# Altium schematic sheet TL074.SchDoc
size A4; SheetNumber: 2; SheetTotal: 3
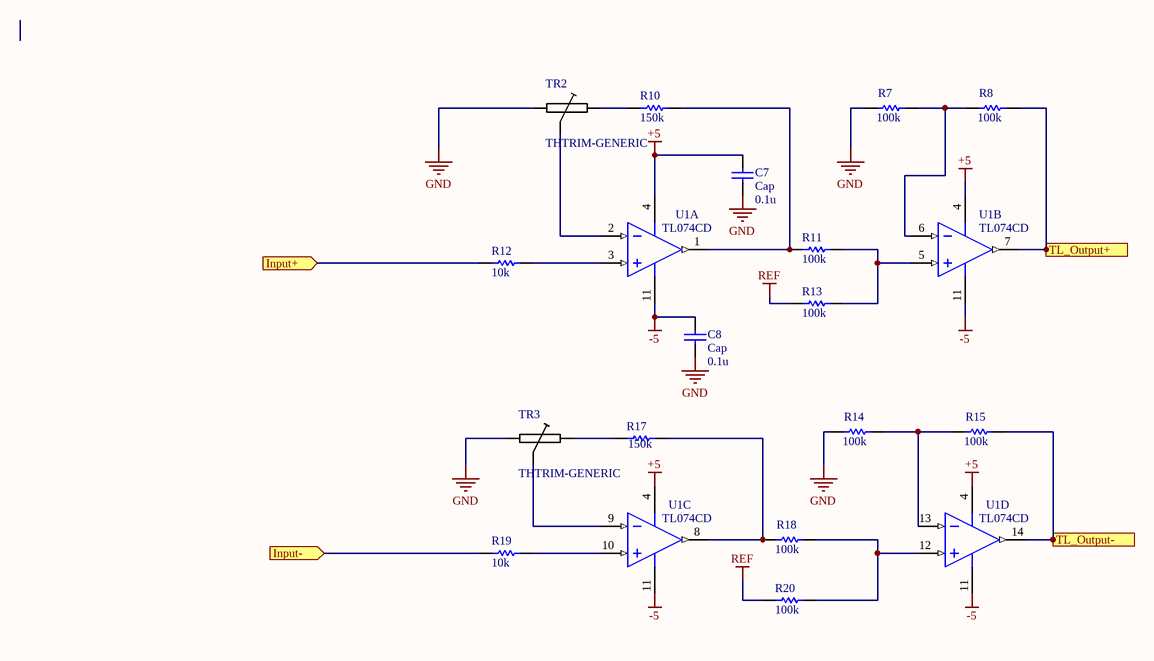
[diagram p0: TL074.SchDoc]

## Parts
C7  Cap  value 0.1u  [C1206]
C8  Cap  value 0.1u  [C1206]
R7  100k  [RESC3216X89X51LL25T25]
R8  100k  [RESC3216X89X51LL25T25]
R10  150k  [RESC3216X89X51LL25T25]
R11  100k  [RESC3216X89X51LL25T25]
R12  10k  [RESC3216X89X51LL25T25]
R13  100k  [RESC3216X89X51LL25T25]
R14  100k  [RESC3216X89X51LL25T25]
R15  100k  [RESC3216X89X51LL25T25]
R17  150k  [RESC3216X89X51LL25T25]
R18  100k  [RESC3216X89X51LL25T25]
R19  10k  [RESC3216X89X51LL25T25]
R20  100k  [RESC3216X89X51LL25T25]
TR2  THTRIM-GENERIC  [TRIMMER-MT]
TR3  THTRIM-GENERIC  [TRIMMER-MT]
U1  TL074CD  [D0014A_M]  (parts A,B,C,D of 4)

## Ports
Input+ (in), Input- (in), TL_Output+ (out), TL_Output- (out)

## Nets
+5: C7.1 U1.4(VCC+)
-5: C8.1 U1.11(VCC-)
GND: C7.2 C8.2 R7.2 R14.2 TR2.1 TR3.1
REF: R13.2 R20.2
Input+: R12.2 ; port Input+
Input-: R19.2 ; port Input-
TL_Output+: R8.1 U1.7(OUT2) ; port TL_Output+
TL_Output-: R15.1 U1.14(OUT4) ; port TL_Output-
NetR7_1: R7.1 R8.2 U1.6(IN2-)
NetR10_1: R10.1 R11.2 U1.1(OUT1)
NetR10_2: R10.2 TR2.2
NetR11_1: R11.1 R13.1 U1.5(IN2+)
NetR12_1: R12.1 U1.3(IN1+)
NetR14_1: R14.1 R15.2 U1.13(IN4-)
NetR17_1: R17.1 R18.2 U1.8(OUT3)
NetR17_2: R17.2 TR3.2
NetR18_1: R18.1 R20.1 U1.12(IN4+)
NetR19_1: R19.1 U1.10(IN3+)
NetTR2_W: TR2.W U1.2(IN1-)
NetTR3_W: TR3.W U1.9(IN3-)

## Library data of the parts
C7 C8 = Cap: Capacitor; Published: 8-Jun-2000; LatestRevisionDate: 17-Jul-2002; LatestRevisionNote: Re-released for DXP Platform.; PackageReference: RAD-0.3; Publisher: Altium Limited; PackageDescription: Radial Cap, Thru-Hole; 2 Leads; 0.3 in Pin Spacing
R7 R8 R10-R15 R17-R20 = CMP-2003-04376-1: Part Number: WSLP1206R0500FEA; Manufacturer: Vishay Dale
TR2 TR3 = THTRIM-GENERIC: TRIMMABLE RESISTOR
U1 = CMP-0017-00005-2: Quad Low-Noise JFET-Input General-Purpose Operational Amplifier, 7 to 36 V, 0 to 70 degC, 14-pin SOIC (D14), Green (RoHS & no Sb/Br); Manufacturer: Texas Instruments; Iq per channel(Max)(mA): 2.5; CMRR(Min)(dB): 70; Offset Drift(Typ)(uV/C): 18; Slew Rate(Typ)(V/us): 13; Rating: Military; Number of Channels: 4; Total Supply Voltage(Min)(+5V is 5, +/-5V is 10): 7; Sub Family: General Purpose Amplifier, High Supply Voltage Amplifier (>=30V); IIB(Max)(pA): 200; Total Supply Voltage(Max)(+5V is 5, +/-5V is 10): 36; Vio (25C)(Max)(mV): 10; GBW(Typ)(MHz): 3; ComponentLink1Description: Manufacturer URL; ComponentLink2Description: Datasheet; PackageDescription: 14-Pin Plastic Small Outline, Body 8.65 x 3.90 mm, Pitch 1.27 mm; Mounting Technology: Surface Mount; ComponentLink2URL: http://www.ti.com/lit/ds/symlink/tl074.pdf; PartNumber: TL074CD; Vn at 1kHz(Typ)(nV/rtHz): 18; Eco-Plan: Green (RoHS & no Sb/Br); ComponentLink1URL: http://www.ti.com/; PackageVersion: 4040047-5/M, 06/2011; ComponentLink3Description: Package Specification; DatasheetVersion: SLOS080J; Code_JEDEC: MS-012; PackageReference: D0014A; ComponentLink3URL: http://www.ti.com/lit/ml/mpds177g/mpds177g.pdf